# Altium schematic sheet Sensing.SchDoc
size A4; SheetNumber: 4; SheetTotal: 7; SPICEModelCacheKMZCHKNF: <root> / <DocumentId>KMZCHKNF</DocumentId> / <CacheFrame Number="0"> / <Model Name="0603_885012206062_3.3nf" Kind="CKT"> / <Text>******* / .subckt 0603_885012206062_3.3nF 1 2 / Rser 1 3 0.09865 / Lser 2 4 0.0000000003316 / C1 3 4 0.0000000033 / Rpar 3 4 10000000000 / .ends 0603_885012206062_3.3nF</Text> / </Model> / </CacheFrame> / </root>
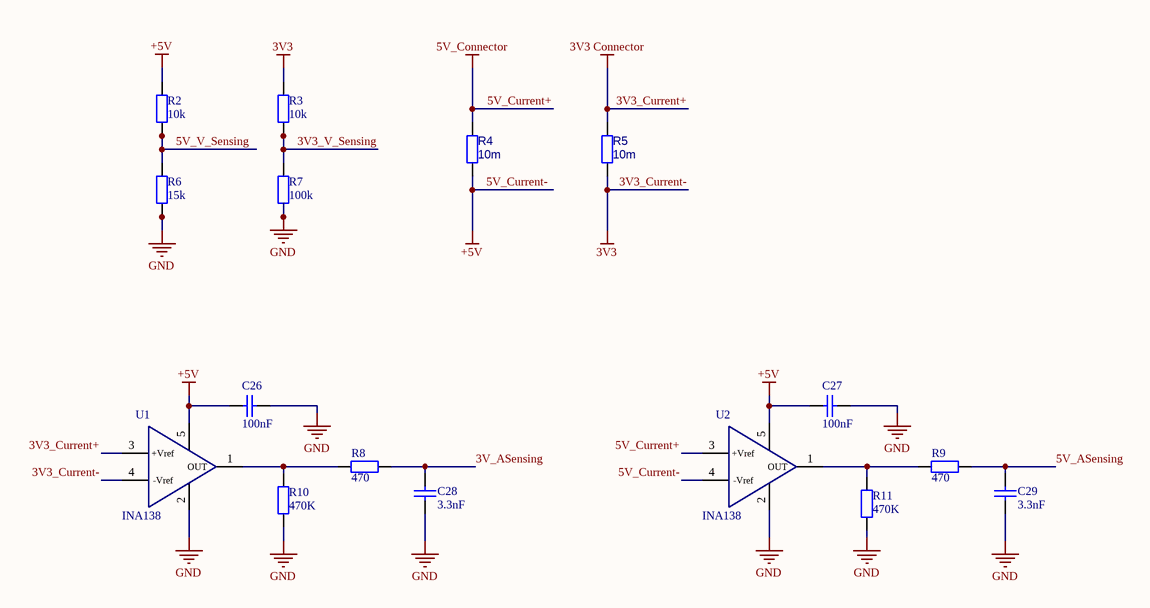
[diagram p0: Sensing.SchDoc]

## Parts
C26  value 100nF  [WCAP-CSGP_0603_L1.6W0.8H0.8_Reflow]  (hidden comment: 885012206071)
C27  value 100nF  [WCAP-CSGP_0603_L1.6W0.8H0.8_Reflow]  (hidden comment: 885012206071)
C28  value 3.3nF  [WCAP-CSGP_0603_L1.6W0.8H0.8_Reflow]  (hidden comment: 885012206062)
C29  value 3.3nF  [WCAP-CSGP_0603_L1.6W0.8H0.8_Reflow]  (hidden comment: 885012206062)
R2  value 10k  [WRIS-RSKS_0603_Reflow]  (hidden comment: 560112116005)
R3  value 10k  [WRIS-RSKS_0603_Reflow]  (hidden comment: 560112116005)
R4  10m  [580070763010-Footprint-1]
R5  10m  [580070763010-Footprint-1]
R6  value 15k  [WRIS-RSKS_0603_Reflow]  (hidden comment: 560112116035)
R7  value 100k  [WRIS-RSKS_0603_Reflow]  (hidden comment: 560112116004)
R8  value 470  [WRIS-RSKS_0603_Reflow]  (hidden comment: 560112116067)
R9  value 470  [WRIS-RSKS_0603_Reflow]  (hidden comment: 560112116067)
R10  value 470K  [WRIS-RSKS_0603_Reflow]  (hidden comment: 560112116019)
R11  value 470K  [WRIS-RSKS_0603_Reflow]  (hidden comment: 560112116019)
U1  INA138  [INA138-Footprint-1]
U2  INA138  [INA138-Footprint-1]

## Nets
3V3_Current+: R5.2 U1.3(+Vref)  [also labelled 3V3 Connector]
3V3_Current-: R3.2 R5.1 U1.4(-Vref)  [also labelled 3V3]
5V_Current+: R4.2 U2.3(+Vref)  [also labelled 5V_Connector]
5V_Current-: C26.2 C27.2 R2.2 R4.1 U1.5(V+) U2.4(-Vref) U2.5(V+)  [also labelled +5V]
GND: C26.1 C27.1 C28.1 C29.1 R6.1 R7.1 R10.1 R11.1 U1.2(GND) U2.2(GND)
3V3_V_Sensing: R3.1 R7.2
3V_ASensing: C28.2 R8.2
5V_ASensing: C29.2 R9.2
5V_V_Sensing: R2.1 R6.2
NetR8_1: R8.1 R10.2 U1.1(OUT)
NetR9_1: R9.1 R11.2 U2.1(OUT)

## Library data of the parts
C26 C27 = CMP-001-00661-1: WCAP-CSGP Multilayer Ceramic Chip Capacitor, General Purpose, size 0603, X7R, 100nF, 25VDC; Manufacturer: Wurth Elektronik; Dissipation Factor: 3.5%; Capacitance Tolerance: +/-10%; Insulation Resistance: 5GOhm; Technical Reference: X7R0603104K025DFCT10000; Rated Voltage (DC): 25V; Packaging: Tape and Reel; Height: 0.8mm; Mount: Surface Mount; Source: WCAP-CSGP.SchLib; Component Type: Standard; Category: Multilayer Ceramic Chip Capacitors; Operating Temperature Min: -55°C; Case/Package: 0603; ComponentLink2Description: Datasheet Link; Width: 0.8mm; ComponentLink1URL: https://www.we-online.com/redexpert/article/885012206071?ad; Length: 1.6mm; Operating Temperature Max: 125°C; Match Code: WCAP-CSGP; ComponentLink2URL: https://www.we-online.com/redexpert/spec/885012206071?ad; Design Item ID: 885012206071; ComponentLink1Description: Website Link; Manufacturer Part Number: 885012206071; Pins: 2; Ceramic Type: X7R
C28 C29 = CMP-001-00652-1: WCAP-CSGP Multilayer Ceramic Chip Capacitor, General Purpose, size 0603, X7R, 3.3nF, 25VDC; Manufacturer: Wurth Elektronik; Capacitance Tolerance: +/-10%; Technical Reference: X7R0603332K025DFCT10000; Dissipation Factor: 3.5%; Rated Voltage (DC): 25V; Insulation Resistance: 10GOhm; ComponentLink2Description: Datasheet Link; Source: WCAP-CSGP.SchLib; Pins: 2; Operating Temperature Min: -55°C; Length: 1.6mm; ComponentLink2URL: https://www.we-online.com/redexpert/spec/885012206062?ad; Ceramic Type: X7R; Manufacturer Part Number: 885012206062; ComponentLink1URL: https://www.we-online.com/redexpert/article/885012206062?ad; ComponentLink1Description: Website Link; Mount: Surface Mount; Case/Package: 0603; Packaging: Tape and Reel; Component Type: Standard; Height: 0.8mm; Operating Temperature Max: 125°C; Width: 0.8mm; Match Code: WCAP-CSGP; Category: Multilayer Ceramic Chip Capacitors; Design Item ID: 885012206062
R2 R3 = CMP-009-00328-1: WRIS-RSKS Thick Film Resistor, size 0603, 10000Ohm, 100mW; Manufacturer: Wurth Elektronik; Limiting Element Voltage: 75V; Temperature Coefficient of Resistance Max: 100ppm/°C; Resistance Tolerance: +/-1%; Temperature Coefficient of Resistance Min: -100ppm/°C; ComponentLink1Description: Website Link; Case/Package: 0603; Pins: 2; Match Code: WRIS-RSKS; Operating Temperature Max: 155°C; Width: 0.8mm; Design Item ID: 560112116005; Length: 1.6mm; ComponentLink2Description: Datasheet Link; ComponentLink2URL: https://www.we-online.com/redexpert/spec/560112116005?ad; Packaging: Tape and Reel; Source: WRIS-RSKS.SchLib; Height: 0.45mm; Manufacturer Part Number: 560112116005; Component Type: Standard; Mount: Surface Mount; Operating Temperature Min: -55°C; Rated Power: 100mW; ComponentLink1URL: https://www.we-online.com/redexpert/article/560112116005?ad; Category: Thick Film Resistors
R4 R5 = CMP-009-00124-2: Res, 0R01, 1%, 2W, Metal Foil, 0612 Rohs Compliant: Yes
R6 = CMP-009-00358-1: WRIS-RSKS Thick Film Resistor, size 0603, 15000Ohm, 100mW; Manufacturer: Wurth Elektronik; Limiting Element Voltage: 75V; Temperature Coefficient of Resistance Min: -100ppm/°C; Resistance Tolerance: +/-1%; Temperature Coefficient of Resistance Max: 100ppm/°C; Match Code: WRIS-RSKS; Design Item ID: 560112116035; Case/Package: 0603; ComponentLink2URL: https://www.we-online.com/redexpert/spec/560112116035?ad; Category: Thick Film Resistors; Source: WRIS-RSKS.SchLib; ComponentLink2Description: Datasheet Link; Pins: 2; ComponentLink1Description: Website Link; Operating Temperature Max: 155°C; Height: 0.45mm; Length: 1.6mm; Component Type: Standard; Packaging: Tape and Reel; Manufacturer Part Number: 560112116035; Width: 0.8mm; Rated Power: 100mW; Mount: Surface Mount; ComponentLink1URL: https://www.we-online.com/redexpert/article/560112116035?ad; Operating Temperature Min: -55°C
R7 = CMP-009-00327-1: WRIS-RSKS Thick Film Resistor, size 0603, 100000Ohm, 100mW; Manufacturer: Wurth Elektronik; Temperature Coefficient of Resistance Min: -100ppm/°C; Resistance Tolerance: +/-1%; Limiting Element Voltage: 75V; Temperature Coefficient of Resistance Max: 100ppm/°C; Height: 0.45mm; ComponentLink1URL: https://www.we-online.com/redexpert/article/560112116004?ad; Packaging: Tape and Reel; Match Code: WRIS-RSKS; Operating Temperature Max: 155°C; ComponentLink2Description: Datasheet Link; ComponentLink1Description: Website Link; Category: Thick Film Resistors; Operating Temperature Min: -55°C; Length: 1.6mm; Source: WRIS-RSKS.SchLib; Rated Power: 100mW; Mount: Surface Mount; Manufacturer Part Number: 560112116004; ComponentLink2URL: https://www.we-online.com/redexpert/spec/560112116004?ad; Component Type: Standard; Width: 0.8mm; Case/Package: 0603; Pins: 2; Design Item ID: 560112116004
R8 R9 = CMP-009-00390-1: WRIS-RSKS Thick Film Resistor, size 0603, 470Ohm, 100mW; Manufacturer: Wurth Elektronik; Limiting Element Voltage: 75V; Temperature Coefficient of Resistance Max: 100ppm/°C; Resistance Tolerance: +/-1%; Temperature Coefficient of Resistance Min: -100ppm/°C; Rated Power: 100mW; Height: 0.45mm; ComponentLink2Description: Datasheet Link; Component Type: Standard; ComponentLink1URL: https://www.we-online.com/redexpert/article/560112116067?ad; ComponentLink1Description: Website Link; Operating Temperature Min: -55°C; Match Code: WRIS-RSKS; Mount: Surface Mount; Case/Package: 0603; Source: WRIS-RSKS.SchLib; Length: 1.6mm; Category: Thick Film Resistors; Operating Temperature Max: 155°C; Pins: 2; Packaging: Tape and Reel; Manufacturer Part Number: 560112116067; ComponentLink2URL: https://www.we-online.com/redexpert/spec/560112116067?ad; Width: 0.8mm; Design Item ID: 560112116067
R10 R11 = CMP-009-00342-1: WRIS-RSKS Thick Film Resistor, size 0603, 470000Ohm, 100mW; Manufacturer: Wurth Elektronik; Temperature Coefficient of Resistance Min: -100ppm/°C; Resistance Tolerance: +/-1%; Limiting Element Voltage: 75V; Temperature Coefficient of Resistance Max: 100ppm/°C; Component Type: Standard; ComponentLink2URL: https://www.we-online.com/redexpert/spec/560112116019?ad; ComponentLink1Description: Website Link; Height: 0.45mm; Source: WRIS-RSKS.SchLib; ComponentLink1URL: https://www.we-online.com/redexpert/article/560112116019?ad; Category: Thick Film Resistors; Mount: Surface Mount; Operating Temperature Min: -55°C; Rated Power: 100mW; Pins: 2; Packaging: Tape and Reel; Match Code: WRIS-RSKS; Width: 0.8mm; ComponentLink2Description: Datasheet Link; Design Item ID: 560112116019; Operating Temperature Max: 155°C; Manufacturer Part Number: 560112116019; Length: 1.6mm; Case/Package: 0603
U1 U2 = CMP-014-00004-3: Shunt Current Measure Amplifier; Manufacturer: Texas Instruments; Manufacturer Part Number: INA138NA/3K; ClassName: 1Pyro OPAMP